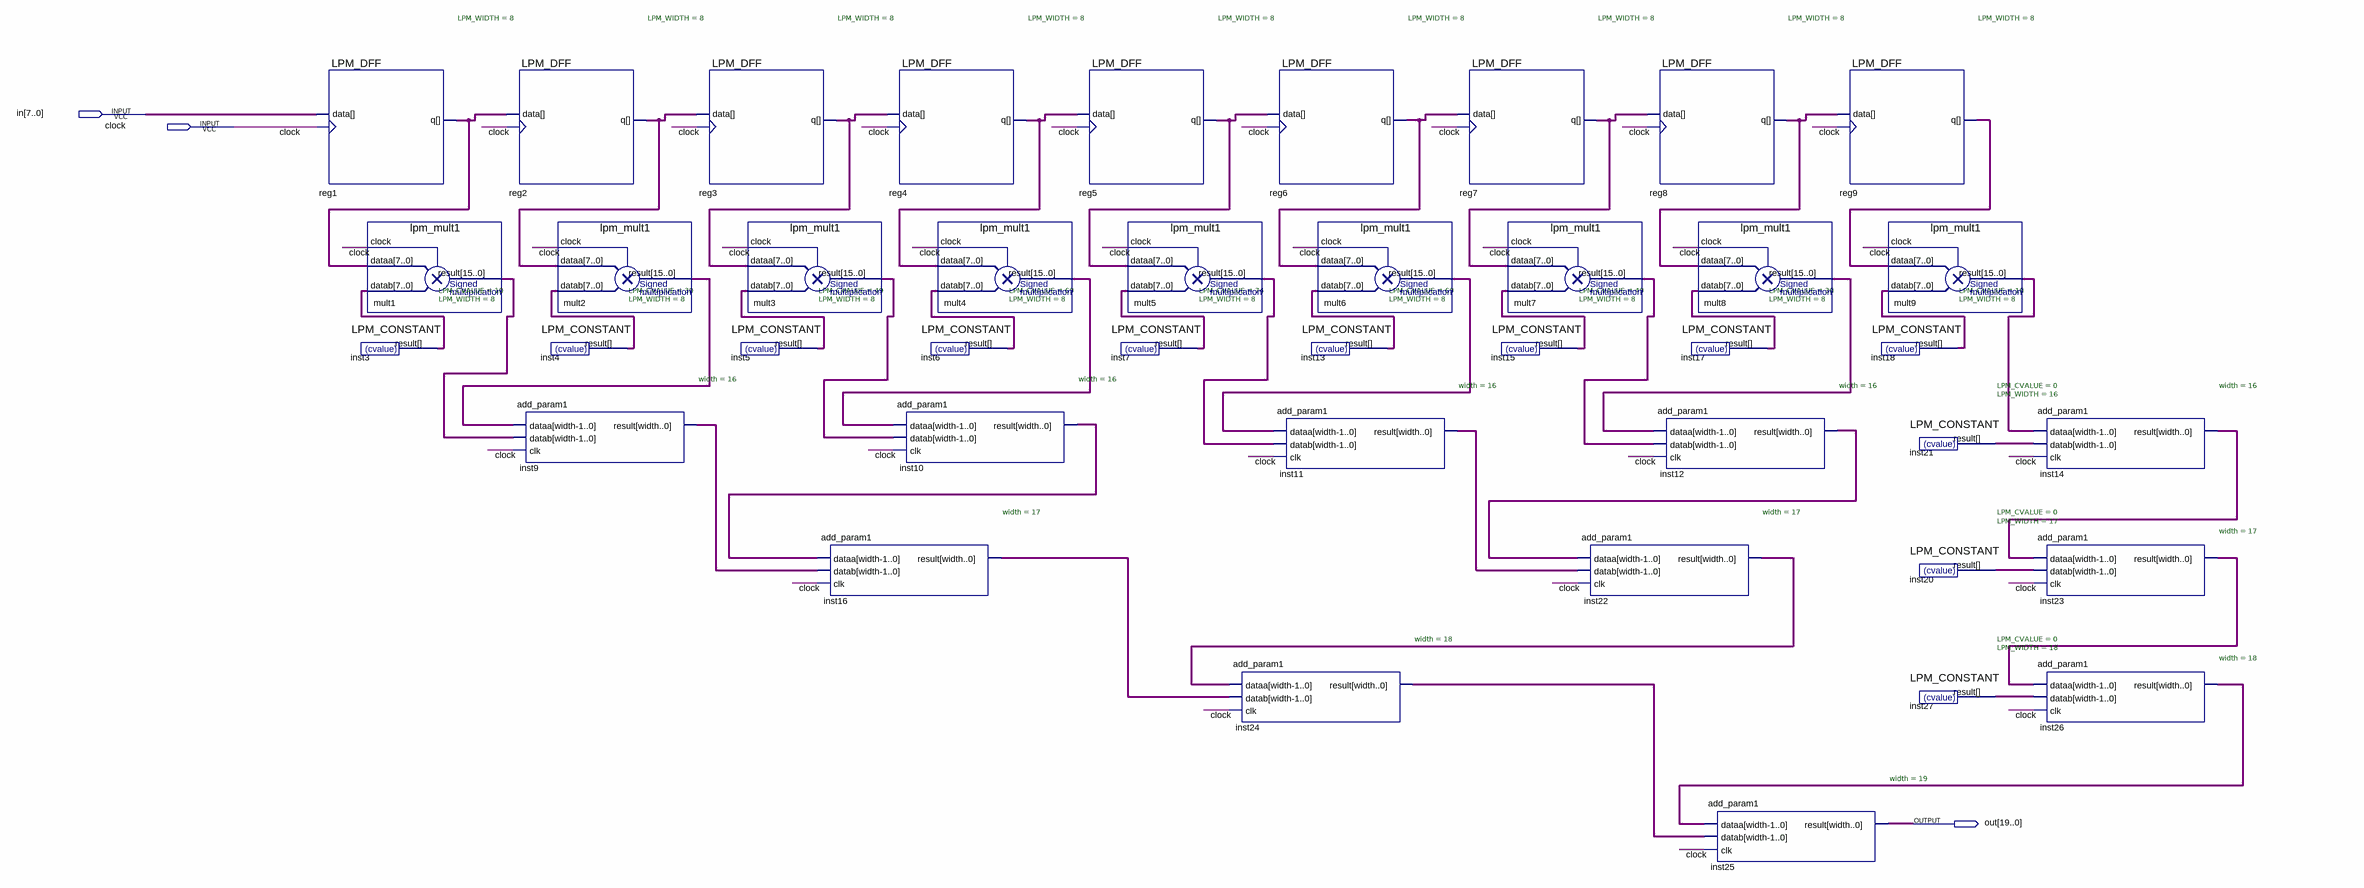
[diagram p0: schematic sheet]
// Quartus schematic my_fir.bdf as structural Verilog: 41 symbols, 3 pins
module my_fir (
  input  [7:0] in,
  input  clock,
  output [19:0] out
);

  wire [7:0] inst3_result, inst4_result, inst5_result, inst6_result, inst7_result, inst13_result,
       inst15_result, inst17_result, inst18_result, reg1_q, reg2_q, reg3_q, reg4_q, reg5_q, reg6_q, reg7_q,
       reg8_q, reg9_q;
  wire [15:0] inst21_result, mult1_result, mult2_result, mult3_result, mult4_result, mult5_result,
       mult6_result, mult7_result, mult8_result, mult9_result;
  wire [16:0] inst9_result, inst10_result, inst11_result, inst12_result, inst14_result, inst20_result;
  wire [17:0] inst16_result, inst22_result, inst23_result, inst27_result;
  wire [18:0] inst24_result, inst26_result;

  LPM_DFF #(.LPM_WIDTH(8)) reg1 (.clock(clock), .data(in), .q(reg1_q));
  lpm_mult1 mult1 (.clock(clock), .dataa(reg1_q), .datab(inst3_result), .result(mult1_result));
  LPM_CONSTANT #(.LPM_CVALUE(10), .LPM_WIDTH(8)) inst3 (.result(inst3_result));
  LPM_DFF #(.LPM_WIDTH(8)) reg2 (.clock(clock), .data(reg1_q), .q(reg2_q));
  LPM_CONSTANT #(.LPM_CVALUE(30), .LPM_WIDTH(8)) inst4 (.result(inst4_result));
  add_param1 #(.width(16)) inst9 (.dataa(mult2_result), .datab(mult1_result), .clk(clock), .result(inst9_result));
  lpm_mult1 mult2 (.clock(clock), .dataa(reg2_q), .datab(inst4_result), .result(mult2_result));
  LPM_DFF #(.LPM_WIDTH(8)) reg3 (.clock(clock), .data(reg2_q), .q(reg3_q));
  LPM_CONSTANT #(.LPM_CVALUE(49), .LPM_WIDTH(8)) inst5 (.result(inst5_result));
  lpm_mult1 mult3 (.clock(clock), .dataa(reg3_q), .datab(inst5_result), .result(mult3_result));
  add_param1 #(.width(17)) inst16 (.dataa(inst10_result), .datab(inst9_result), .clk(clock), .result(inst16_result));
  LPM_DFF #(.LPM_WIDTH(8)) reg4 (.clock(clock), .data(reg3_q), .q(reg4_q));
  add_param1 #(.width(16)) inst10 (.dataa(mult4_result), .datab(mult3_result), .clk(clock), .result(inst10_result));
  lpm_mult1 mult4 (.clock(clock), .dataa(reg4_q), .datab(inst6_result), .result(mult4_result));
  LPM_CONSTANT #(.LPM_CVALUE(69), .LPM_WIDTH(8)) inst6 (.result(inst6_result));
  LPM_DFF #(.LPM_WIDTH(8)) reg5 (.clock(clock), .data(reg4_q), .q(reg5_q));
  lpm_mult1 mult5 (.clock(clock), .dataa(reg5_q), .datab(inst7_result), .result(mult5_result));
  LPM_CONSTANT #(.LPM_CVALUE(74), .LPM_WIDTH(8)) inst7 (.result(inst7_result));
  add_param1 #(.width(18)) inst24 (.dataa(inst22_result), .datab(inst16_result), .clk(clock), .result(inst24_result));
  LPM_DFF #(.LPM_WIDTH(8)) reg6 (.clock(clock), .data(reg5_q), .q(reg6_q));
  LPM_CONSTANT #(.LPM_CVALUE(69), .LPM_WIDTH(8)) inst13 (.result(inst13_result));
  add_param1 #(.width(16)) inst11 (.dataa(mult6_result), .datab(mult5_result), .clk(clock), .result(inst11_result));
  lpm_mult1 mult6 (.clock(clock), .dataa(reg6_q), .datab(inst13_result), .result(mult6_result));
  LPM_DFF #(.LPM_WIDTH(8)) reg7 (.clock(clock), .data(reg6_q), .q(reg7_q));
  LPM_CONSTANT #(.LPM_CVALUE(49), .LPM_WIDTH(8)) inst15 (.result(inst15_result));
  lpm_mult1 mult7 (.clock(clock), .dataa(reg7_q), .datab(inst15_result), .result(mult7_result));
  add_param1 #(.width(17)) inst22 (.dataa(inst12_result), .datab(inst11_result), .clk(clock), .result(inst22_result));
  LPM_DFF #(.LPM_WIDTH(8)) reg8 (.clock(clock), .data(reg7_q), .q(reg8_q));
  add_param1 #(.width(16)) inst12 (.dataa(mult8_result), .datab(mult7_result), .clk(clock), .result(inst12_result));
  lpm_mult1 mult8 (.clock(clock), .dataa(reg8_q), .datab(inst17_result), .result(mult8_result));
  LPM_CONSTANT #(.LPM_CVALUE(30), .LPM_WIDTH(8)) inst17 (.result(inst17_result));
  add_param1 #(.width(19)) inst25 (.dataa(inst26_result), .datab(inst24_result), .clk(clock), .result(out));
  LPM_DFF #(.LPM_WIDTH(8)) reg9 (.clock(clock), .data(reg8_q), .q(reg9_q));
  lpm_mult1 mult9 (.clock(clock), .dataa(reg9_q), .datab(inst18_result), .result(mult9_result));
  LPM_CONSTANT #(.LPM_CVALUE(10), .LPM_WIDTH(8)) inst18 (.result(inst18_result));
  LPM_CONSTANT #(.LPM_CVALUE(0), .LPM_WIDTH(16)) inst21 (.result(inst21_result));
  LPM_CONSTANT #(.LPM_CVALUE(0), .LPM_WIDTH(17)) inst20 (.result(inst20_result));
  LPM_CONSTANT #(.LPM_CVALUE(0), .LPM_WIDTH(18)) inst27 (.result(inst27_result));
  add_param1 #(.width(16)) inst14 (.dataa(mult9_result), .datab(inst21_result), .clk(clock), .result(inst14_result));
  add_param1 #(.width(17)) inst23 (.dataa(inst14_result), .datab(inst20_result), .clk(clock), .result(inst23_result));
  add_param1 #(.width(18)) inst26 (.dataa(inst23_result), .datab(inst27_result), .clk(clock), .result(inst26_result));
endmodule
